# EAGLE schematic nola2 (EAGLE 8.6.1)
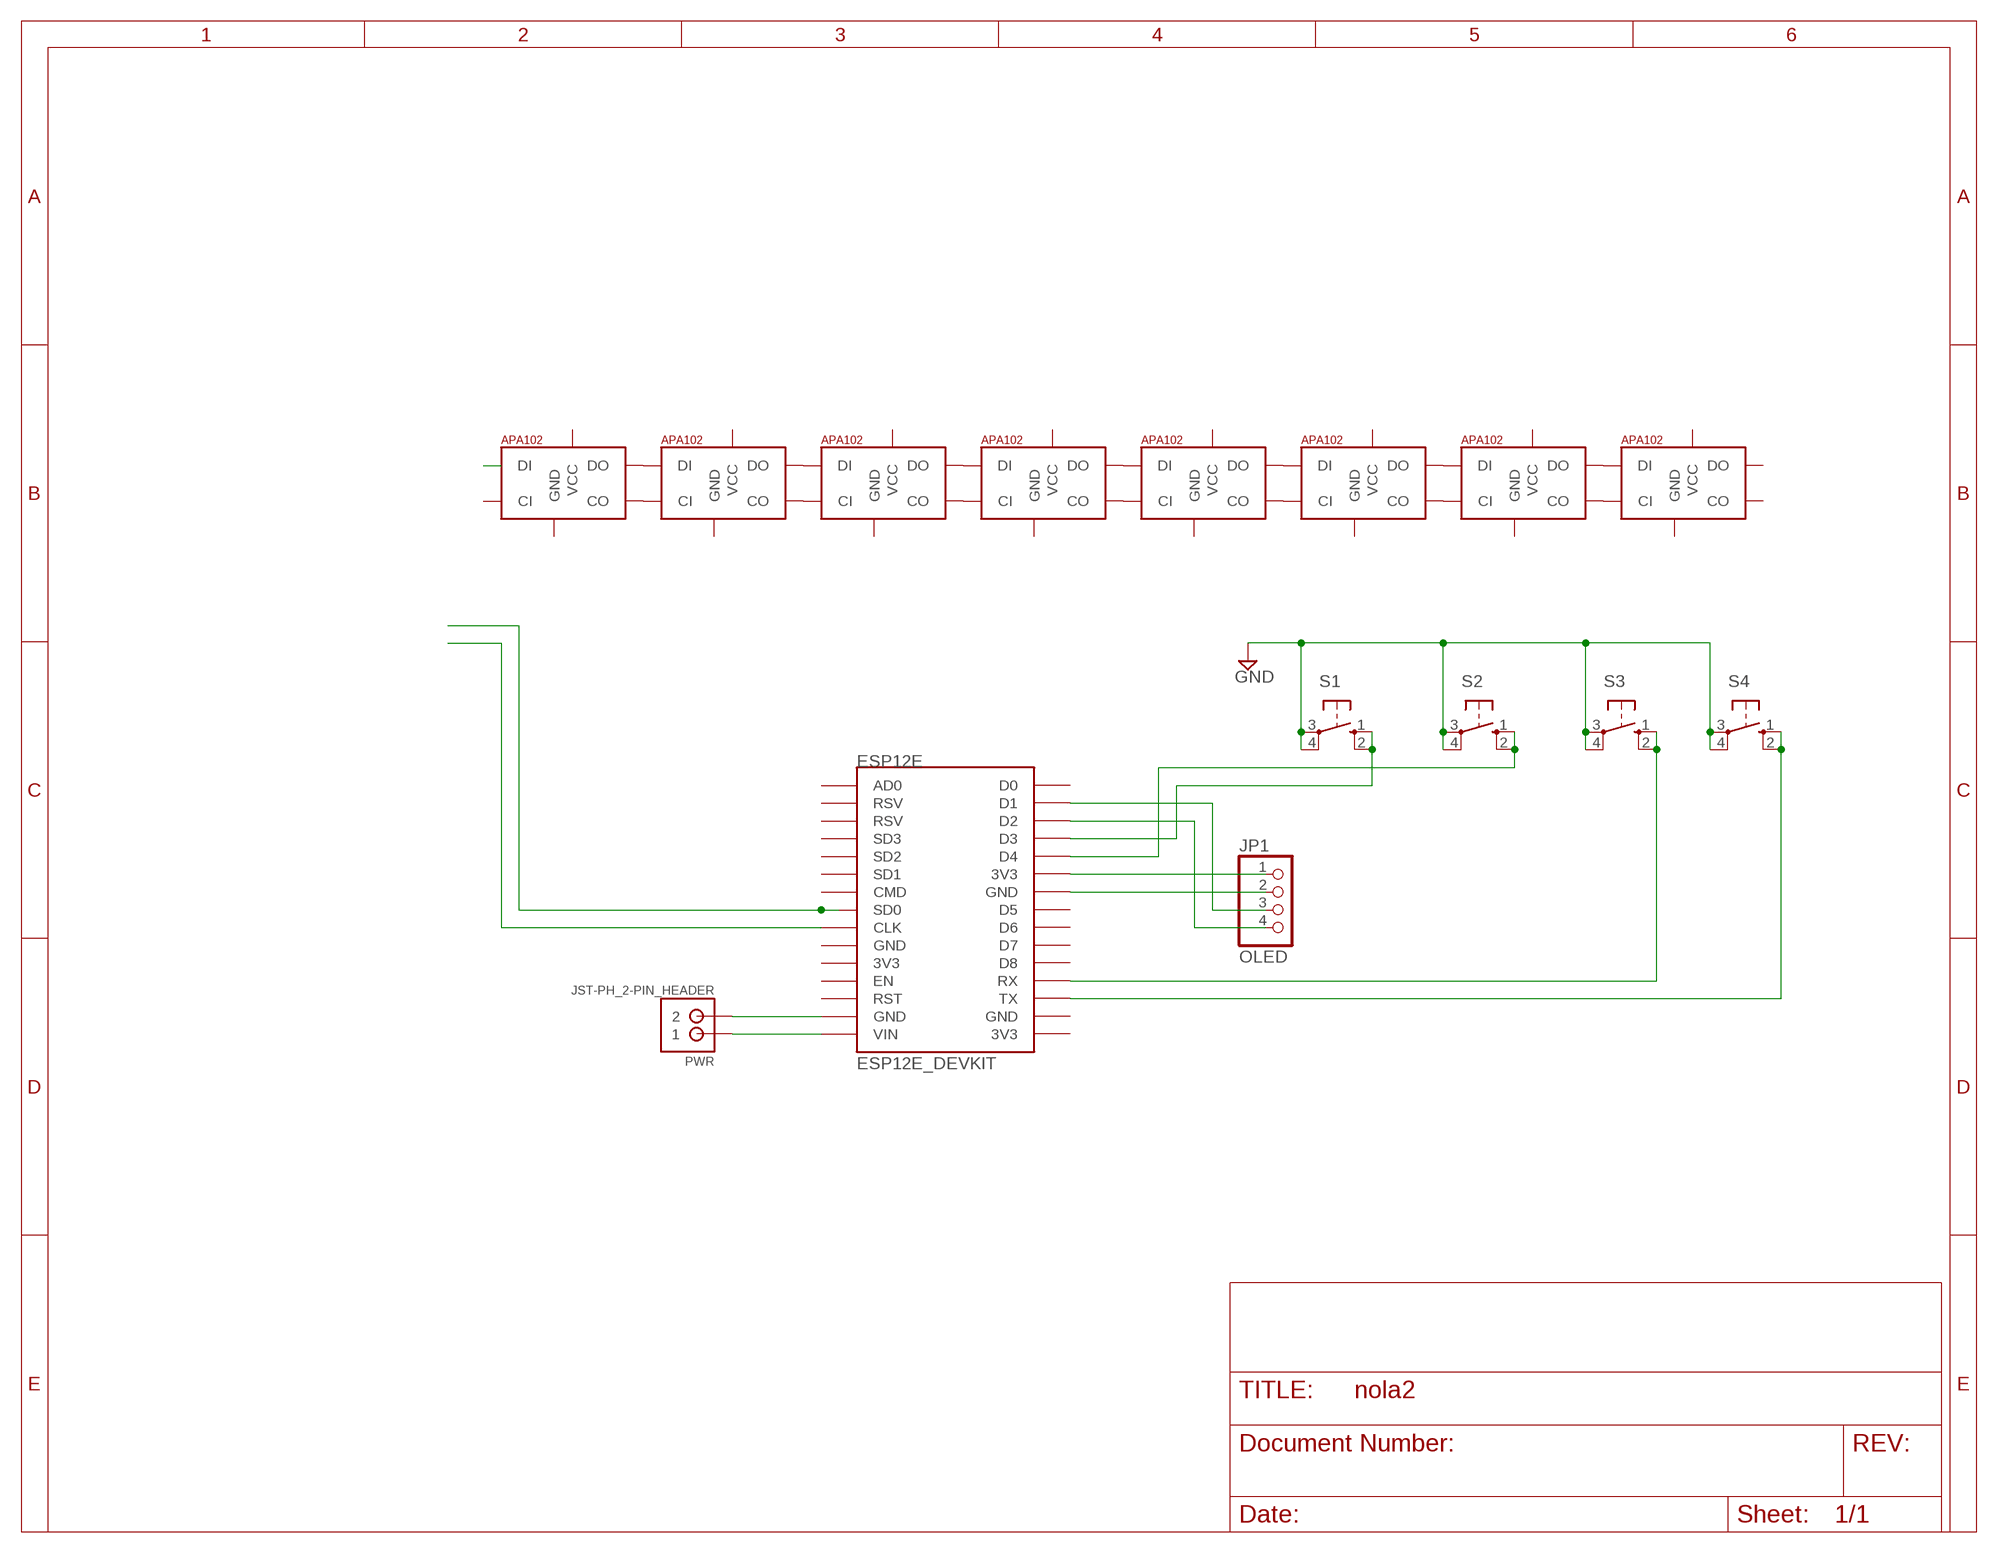
[diagram p0: schematic, sheet 1]

## Parts
ESP12E  ESP12E_DEVKIT  [ESP12E_DEVKIT]
JP1  OLED  PINHD-1X4  [1X04]
LED1  APA1025050  [APA102_5050]
LED2  APA1025050  [APA102_5050]
LED3  APA1025050  [APA102_5050]
LED4  APA1025050  [APA102_5050]
LED5  APA1025050  [APA102_5050]
LED6  APA1025050  [APA102_5050]
LED7  APA1025050  [APA102_5050]
LED8  APA1025050  [APA102_5050]
PWR  JST-PH_2-PIN_HEADER  [JST_B2B-PH_HEADER]
S1  10-XX  [B3F-10XX]
S2  10-XX  [B3F-10XX]
S3  10-XX  [B3F-10XX]
S4  10-XX  [B3F-10XX]

## Nets
GND: S1.3(P) S1.4(P1) S2.3(P) S2.4(P1) S3.3(P) S3.4(P1) S4.3(P) S4.4(P1)
N$1: LED1.3(DO) LED2.4(DI)
N$2: LED1.2(CO) LED2.5(CI)
N$3: LED2.3(DO) LED3.4(DI)
N$4: LED2.2(CO) LED3.5(CI)
N$5: LED3.3(DO) LED4.4(DI)
N$6: LED3.2(CO) LED4.5(CI)
N$7: LED4.3(DO) LED5.4(DI)
N$8: LED4.2(CO) LED5.5(CI)
N$9: LED5.3(DO) LED6.4(DI)
N$10: LED5.2(CO) LED6.5(CI)
N$11: LED6.3(DO) LED7.4(DI)
N$12: LED6.2(CO) LED7.5(CI)
N$13: LED7.3(DO) LED8.4(DI)
N$14: LED7.2(CO) LED8.5(CI)
N$15: LED1.4(DI)
N$16: ESP12E.GND@1(GND) PWR.P2
N$17: ESP12E.3V3@1(3V3) JP1.1
N$18: ESP12E.D1 JP1.3
N$19: ESP12E.SD0
N$20: ESP12E.CLK
N$21: ESP12E.D2 JP1.4
N$22: ESP12E.D3 S1.1(S) S1.2(S1)
N$23: ESP12E.D4 S2.1(S) S2.2(S1)
N$24: ESP12E.RX S3.1(S) S3.2(S1)
N$25: ESP12E.TX S4.1(S) S4.2(S1)
N$26: ESP12E.VIN PWR.P1
N$27: ESP12E.GND@2(GND) JP1.2
Unconnected: ESP12E.3V3@0(3V3) ESP12E.3V3@2(3V3) ESP12E.AD0 ESP12E.CMD ESP12E.D0 ESP12E.D5 ESP12E.D6 ESP12E.D7 ESP12E.D8 ESP12E.EN ESP12E.GND@0(GND) ESP12E.GND@3(GND) ESP12E.RST ESP12E.RSV@0(RSV) ESP12E.RSV@1(RSV) ESP12E.SD1 ESP12E.SD2 ESP12E.SD3 LED1.1(VCC) LED1.5(CI) LED1.6(GND) LED2.1(VCC) LED2.6(GND) LED3.1(VCC) LED3.6(GND) LED4.1(VCC) LED4.6(GND) LED5.1(VCC) LED5.6(GND) LED6.1(VCC) LED6.6(GND) LED7.1(VCC) LED7.6(GND) LED8.1(VCC) LED8.2(CO) LED8.3(DO) LED8.6(GND)

## Library data of the parts
ESP12E = ESP12E_DEVKIT:ESP12E_DEVKIT: ESP12E DEVKIT BOARD
JP1 = pinhead:PINHD-1X4: PIN HEADER
LED1-LED8 = jos-ph:APA102: APA102C 5050 RGB LED -- Adafruit DotStar Single LED Pixel Product Page: https://www.adafruit.com/products/2343 Datasheet: https://cdn-shop.adafruit.com/product-files/2343/APA102C.pdf
PWR = SRG:JST-PH_2-PIN_HEADER: 2-pin JST PH Shrouded Header, top entry P/N B2B-PH-K-S Mating connector PHR-2 Mating cable assembly: Sparkfun PRT-09914 <http://www.sparkfun.com/products/9914>
S1-S4 = switch-omron:10-XX: OMRON SWITCH; MPN: B3F-1000; OC_FARNELL: 176432; OC_NEWARK: 36M3542